# Altium schematic sheet Ports and Display.SchDoc
size A4; SheetNumber: 5; SheetTotal: 6
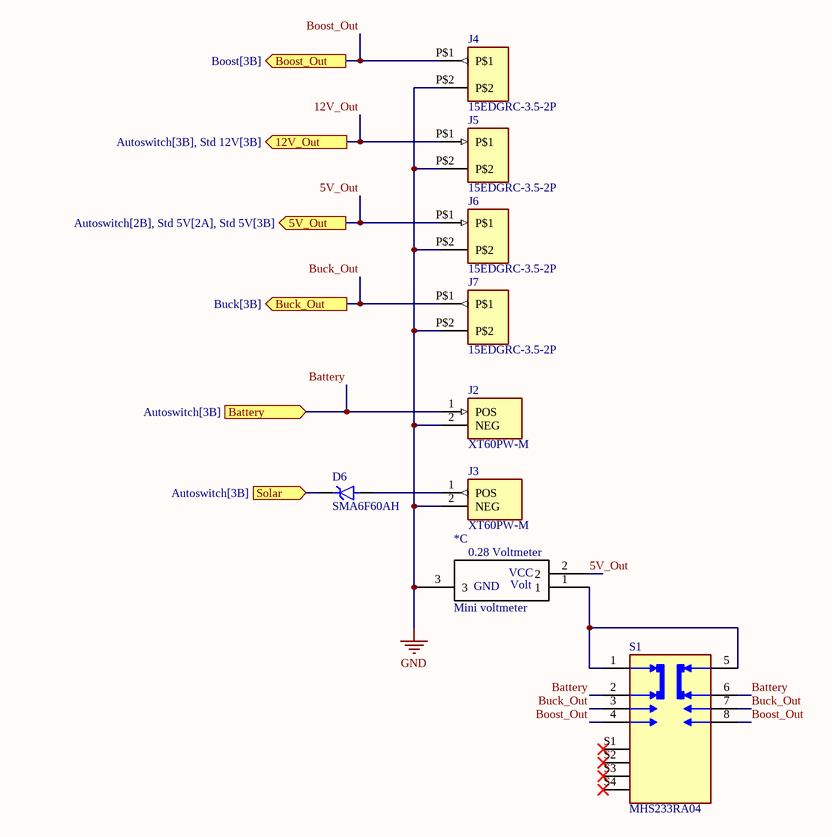
[diagram p0: Ports and Display.SchDoc]

## Parts
*  Mini voltmeter  [New footprint 1]  (part C of 3)
D6  SMA6F60AH  [SODFL5226X100N]
J2  XT60PW-M  [AMASS_XT60PW-M]
J3  XT60PW-M  [AMASS_XT60PW-M]
J4  15EDGRC-3.5-2P  [15EDGRC-3.5-2P-PAK]
J5  15EDGRC-3.5-2P  [15EDGRC-3.5-2P-PAK]
J6  15EDGRC-3.5-2P  [15EDGRC-3.5-2P-PAK]
J7  15EDGRC-3.5-2P  [15EDGRC-3.5-2P-PAK]
S1  MHS233RA04  [SW_MHS233RA04]

## Ports
5V_Out (out, see Autoswitch[2B], Std 5V[2A], Std 5V[3B]), 12V_Out (out, see Autoswitch[3B], Std 12V[3B]), Battery (in, see Autoswitch[3B]), Boost_Out (out, see Boost[3B]), Buck_Out (out, see Buck[3B]), Solar (in, see Autoswitch[3B])

## Nets
GND: *.3 J2.2(NEG) J3.2(NEG) J4.P$2 J5.P$2 J6.P$2 J7.P$2
5V_Out: *.2 J6.P$1 ; port 5V_Out
12V_Out: J5.P$1 ; port 12V_Out
Battery: J2.1(POS) S1.2 S1.6 ; port Battery
Boost_Out: J4.P$1 S1.4 S1.8 ; port Boost_Out
Buck_Out: J7.P$1 S1.3 S1.7 ; port Buck_Out
Solar: D6.1(K) ; port Solar
Net*_1: *.1 S1.1 S1.5
NetD6_2: D6.2(A) J3.1(POS)

Not connected (* = marked no-connect by the designer): S1 S1(SHIELD)* S2(SHIELD)* S3(SHIELD)* S4(SHIELD)*

## Notes on the sheet
- (in symbol CMP-00002-3, part C) 0.28 Voltmeter; VCC; GND; Volt

## Library data of the parts
* = CMP-00002-3: 0-100V
D6 = CMP-004-00031-1: 600W, 70.6V, 5%, Unidirectional, TVS; MF: Taiwan Semiconductor; Design Item ID: SMA6F60AH; Value: *; Case/Package: THIN SMA-2 Taiwan Semiconductor; Source: SMA6F60AH.SchLib; MP: SMA6F60AH; Component Type: Standard; SnapEDA_Link: https://www.snapeda.com/parts/SMA6F60AH/taiwan/view-part/?ref=snap; Check_prices: https://www.snapeda.com/parts/SMA6F60AH/taiwan/view-part/?ref=eda; Pins: 2
J2 J3 = CMP-002-00073-1: Socket, DC supply, male, PIN: 2; MF: AMASS; SnapEDA_Link: https://www.snapeda.com/parts/XT60PW-M/AMASS/view-part/?ref=snap; Design Item ID: XT60PW-M; MP: XT60PW-M; Pins: 2; Value: *; Check_prices: https://www.snapeda.com/parts/XT60PW-M/AMASS/view-part/?ref=eda; Availability: Not in stock; Component Type: Standard; Case/Package: Package; Source: XT60PW-M.SchLib; Price: None
J4-J7 = CMP-002-00077-2: Pluggable terminal block; socket; male; 3.5mm; angled 90Â°; ways: 2; MF: Degson; MP: 15EDGRC-3.5/2P; Pins: 2; Check_prices: https://www.snapeda.com/parts/15EDGRC-3.5/2P/Degson/view-part/?ref=eda; Case/Package: None; Component Type: Standard; Value: *; Source: 15EDGRC-3.5-2P.SchLib; Design Item ID: 15EDGRC-3.5-2P; SnapEDA_Link: https://www.snapeda.com/parts/15EDGRC-3.5/2P/Degson/view-part/?ref=snap
S1 = CMP-011-00013-1: Switch Slide ON ON ON DP3T Side Slide 0.3A 125VAC PC Pins Bracket Mount/Through Hole Tray; MF: TE Connectivity; MP: MHS233RA04; SnapEDA_Link: https://www.snapeda.com/parts/MHS233RA04/TE+Connectivity/view-part/?ref=snap; Component Type: Standard; Pins: 12; Value: *; Design Item ID: MHS233RA04; Case/Package: None; Source: MHS233RA04.SchLib; Check_prices: https://www.snapeda.com/parts/MHS233RA04/TE+Connectivity/view-part/?ref=eda